# EAGLE design BasicGates (EAGLE 9.6.2)
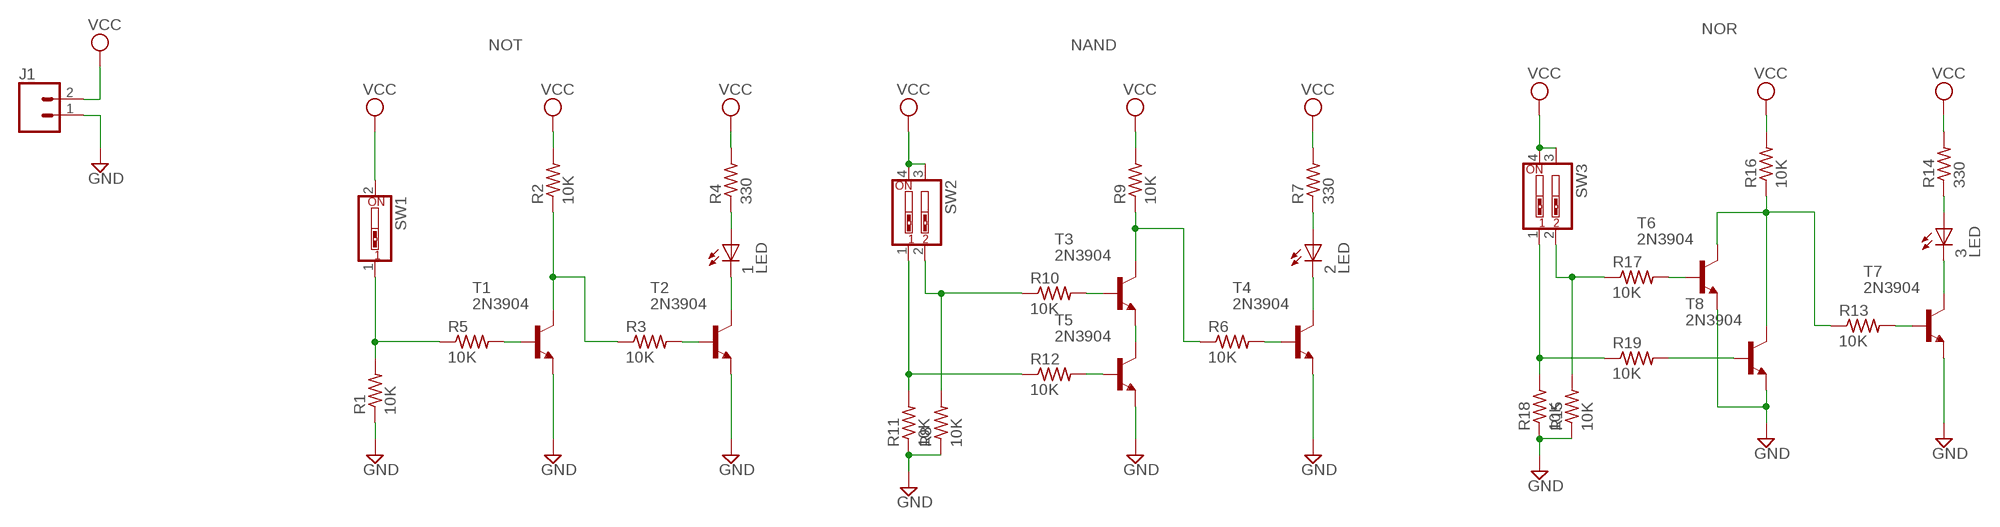
[diagram p0: schematic, sheet 1]

## Parts
1  LED  LED5MM  [LED5MM]
2  LED  LED5MM  [LED5MM]
3  LED  LED5MM  [LED5MM]
J1  CONN_02  [1X02]
R1  10K  R-US_0309/10  [0309/10]
R2  10K  R-US_0309/10  [0309/10]
R3  10K  R-US_0309/10  [0309/10]
R4  330  R-US_0309/10  [0309/10]
R5  10K  R-US_0309/10  [0309/10]
R6  10K  R-US_0309/10  [0309/10]
R7  330  R-US_0309/10  [0309/10]
R8  10K  R-US_0309/10  [0309/10]
R9  10K  R-US_0309/10  [0309/10]
R10  10K  R-US_0309/10  [0309/10]
R11  10K  R-US_0309/10  [0309/10]
R12  10K  R-US_0309/10  [0309/10]
R13  10K  R-US_0309/10  [0309/10]
R14  330  R-US_0309/10  [0309/10]
R15  10K  R-US_0309/10  [0309/10]
R16  10K  R-US_0309/10  [0309/10]
R17  10K  R-US_0309/10  [0309/10]
R18  10K  R-US_0309/10  [0309/10]
R19  10K  R-US_0309/10  [0309/10]
SW1  SW_DIP-1  [EDG-01]
SW2  SW_DIP-2  [EDG-02]
SW3  SW_DIP-2  [EDG-02]
T1  2N3904  [TO92]
T2  2N3904  [TO92]
T3  2N3904  [TO92]
T4  2N3904  [TO92]
T5  2N3904  [TO92]
T6  2N3904  [TO92]
T7  2N3904  [TO92]
T8  2N3904  [TO92]

## Nets
GND: J1.1 R1.1 R8.1 R11.1 R15.1 R18.1 T1.3(E) T2.3(E) T4.3(E) T5.3(E) T6.3(E) T7.3(E) T8.3(E)
N$1: R2.1 R3.1 T1.1(C)
N$2: R5.2 T1.2(B)
N$3: R1.2 R5.1 SW1.1
N$4: R6.2 T4.2(B)
N$5: 2.A R7.1
N$6: 2.K(C) T4.1(C)
N$7: R6.1 R9.1 T3.1(C)
N$8: R10.2 T3.2(B)
N$9: R8.2 R10.1 SW2.2
N$10: T3.3(E) T5.1(C)
N$11: R12.2 T5.2(B)
N$12: R11.2 R12.1 SW2.1
N$13: R13.2 T7.2(B)
N$14: 3.A R14.1
N$15: 3.K(C) T7.1(C)
N$16: R13.1 R16.1 T6.1(C) T8.1(C)
N$17: R17.2 T6.2(B)
N$18: R15.2 R17.1 SW3.2
N$20: R19.2 T8.2(B)
N$21: R18.2 R19.1 SW3.1
N$121: 1.A R4.1
N$122: R3.2 T2.2(B)
N$124: 1.K(C) T2.1(C)
VCC: J1.2 R2.2 R4.2 R7.2 R9.2 R14.2 R16.2 SW1.2 SW2.3 SW2.4 SW3.3 SW3.4

## Notes on the sheet
- NOR
- NOT | NAND

## Library data of the parts
1-3 = led:LED: LED OSRAM: - CHIPLED LG R971, LG N971, LY N971, LG Q971, LY Q971, LO R971, LY R971 LH N974, LH R974 LS Q976, LO Q976, LY Q976 LO Q996 - Hyper CHIPLED LW Q18S LB Q993, LB Q99A, LB R99A - SideLED LS A670, LO A670, LY A670, LG A670, LP A670 LB A673, LV A673, LT A673, LW A673 LH A674 LY A675 LS A676, LA A676, LO A676, LY A676, LW A676 LS A679, LY A679, LG A679 - Hyper Micro SIDELED® LS Y876, LA Y876, LO Y876, LY Y876 LT Y87S - SmartLED LW L88C, LW L88S LB L89C, LB L89S, LG L890 LS L89K, LO L89K, LY L89K LS L896, LA L896, LO L896, LY L896 - TOPLED LS T670, LO T670, LY T670, LG T670, LP T670 LSG T670, LSP T670, LSY T670, LOP T670, LYG T670 LG T671, LOG T671, LSG T671 LB T673, LV T673, LT T673, LW T673 LH T674 LS T676, LA T676, LO T676, LY T676, LB T676, LH T676, LSB T676, LW T676 LB T67C, LV T67C, LT T67C, LS T67K, LO T67K, LY T67K, LW E67C LS E67B, LA E67B, LO E67B, LY E67B, LB E67C, LV E67C, LT E67C LW T67C LS T679, LY T679, LG T679 LS T770, LO T770, LY T770, LG T770, LP T770 LB T773, LV T773, LT T773, LW T773 LH T774 LS E675, LA E675, LY E675, LS T675 LS T776, LA T776, LO T776, LY T776, LB T776 LHGB T686 LT T68C, LB T68C - Hyper Mini TOPLED® LB M676 - Mini TOPLED Santana® LG M470 LS M47K, LO M47K, LY M47K Source: http://www.osram.convergy.de LUXEON: - LUMILED® LXK2-PW12-R00, LXK2-PW12-S00, LXK2-PW14-U00, LXK2-PW14-V00 LXK2-PM12-R00, LXK2-PM12-S00, LXK2-PM14-U00 LXK2-PE12-Q00, LXK2-PE12-R00, LXK2-PE12-S00, LXK2-PE14-T00, LXK2-PE14-U00 LXK2-PB12-K00, LXK2-PB12-L00, LXK2-PB12-M00, LXK2-PB14-N00, LXK2-PB14-P00, LXK2-PB14-Q00 LXK2-PR12-L00, LXK2-PR12-M00, LXK2-PR14-Q00, LXK2-PR14-R00 LXK2-PD12-Q00, LXK2-PD12-R00, LXK2-PD12-S00 LXK2-PH12-R00, LXK2-PH12-S00 LXK2-PL12-P00, LXK2-PL12-Q00, LXK2-PL12-R00 Source: www.luxeon.com KINGBRIGHT: KA-3528ASYC Source: www.kingbright.com
J1 = SparkFun-Connectors:CONN_02: Multi connection point. Often used as Generic Header-pin footprint for 0.1 inch spaced/style header connections On any of the 0.1 inch spaced packages, you can populate with these: Break Away Headers - Straight <https://www.sparkfun.com/products/116> (PRT-00116) Break Away Male Headers - Right Angle <https://www.sparkfun.com/products/553> (PRT-00553) Female Headers <https://www.sparkfun.com/products/115> (PRT-00115) Break Away Headers - Machine Pin <https://www.sparkfun.com/products/117> (PRT-00117) Break Away Female Headers - Swiss Machine Pin <https://www.sparkfun.com/products/743> (PRT-00743) For SCREWTERMINALS and SPRING TERMINALS visit here: Screw Terimnals on SparkFun.com <https://www.sparkfun.com/search/results?term=Screw+Terminals> (5mm/3.5mm/2.54mm spacing) This device is also useful as a general connection point to wire up your design to another part of your project. Our various solder wires solder well into these plated through hole pads. Hook-Up Wire - Assortment (Stranded, 22 AWG) <https://www.sparkfun.com/products/11375> (PRT-11375) Hook-Up Wire - Assortment (Solid Core, 22 AWG) <https://www.sparkfun.com/products/11367> (PRT-11367) View the entire wire category on our website here <https://www.sparkfun.com/categories/141> Special notes: Molex polarized connector foot print use with: PRT-08233 with associated crimp pins and housings. 2.54_SCREWTERM for use with PRT-10571. 3.5mm Screw Terminal footprints for PRT-08084 5mm Screw Terminal footprints for use with PRT-08432
R1-R19 = resistor:R-US_: RESISTOR, American symbol
SW1 = special:SW_DIP-1: DIP SWITCH
SW2 SW3 = special:SW_DIP-2: DIP SWITCH
T1-T8 = transistor:2N3904: NPN TRANSISTOR

## Board
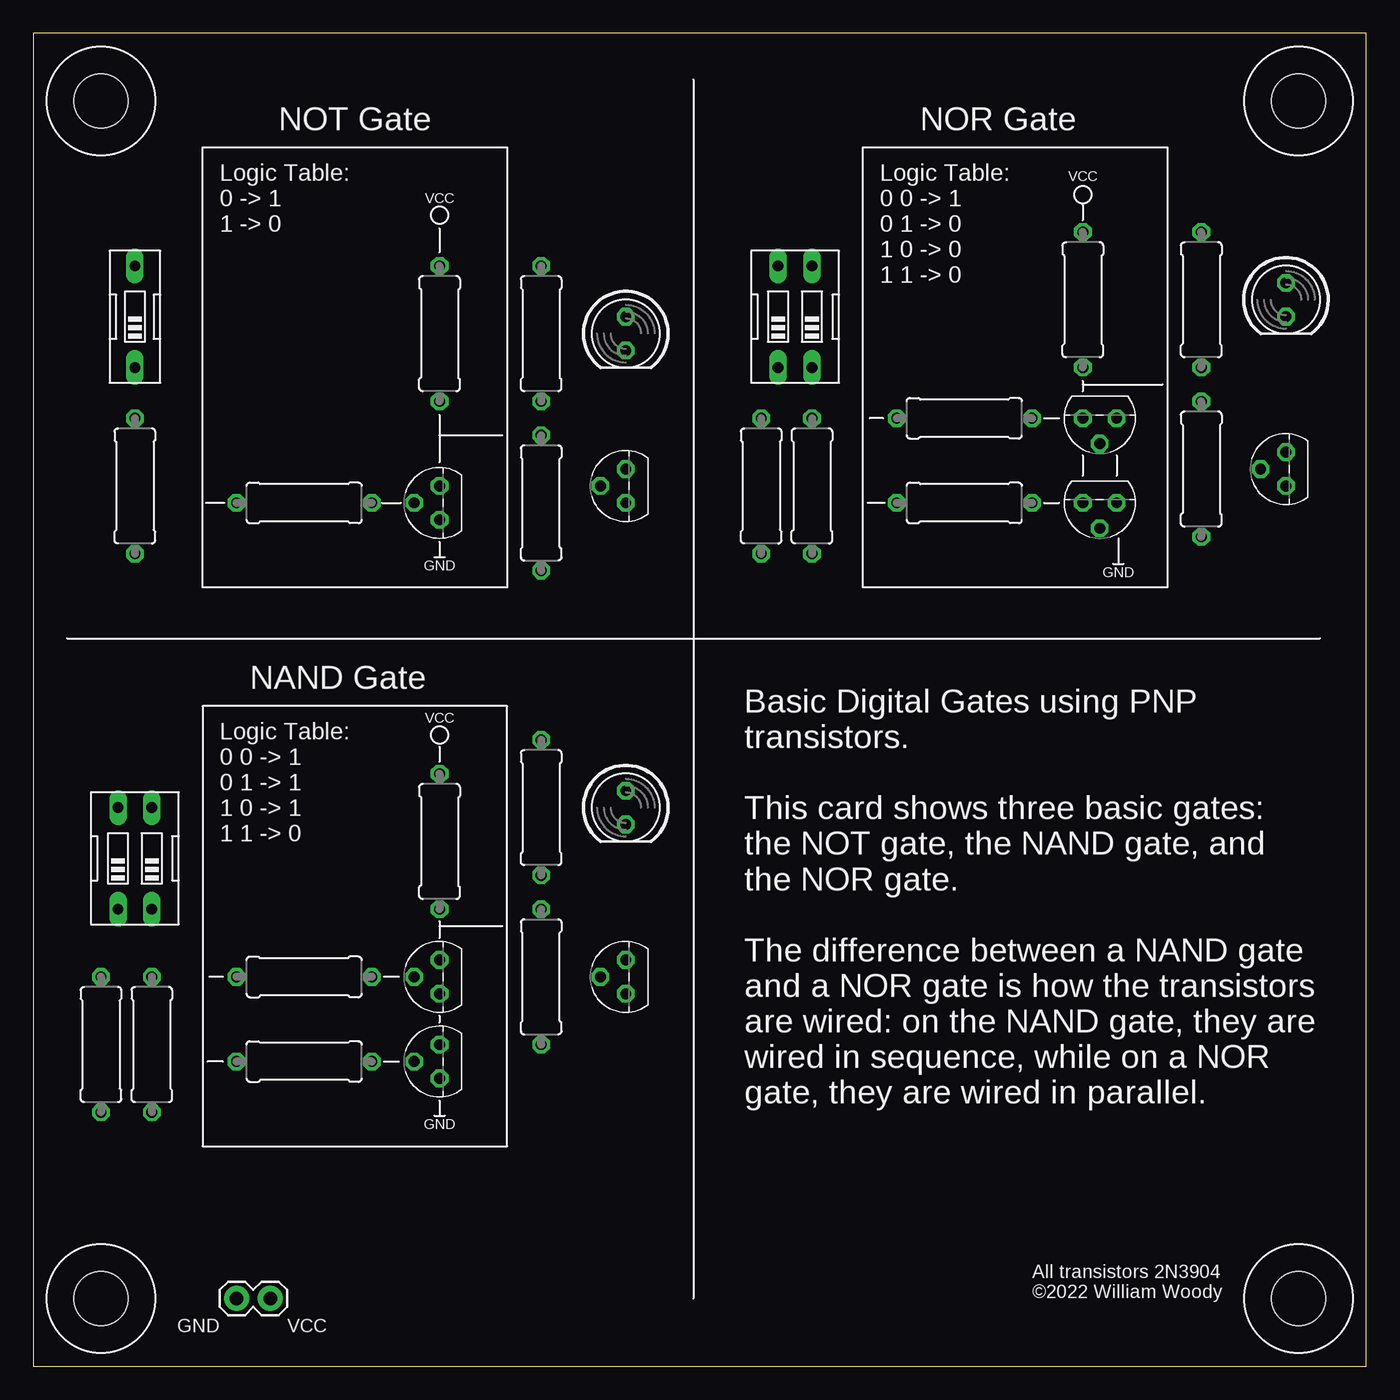
[diagram p1: board, top side]
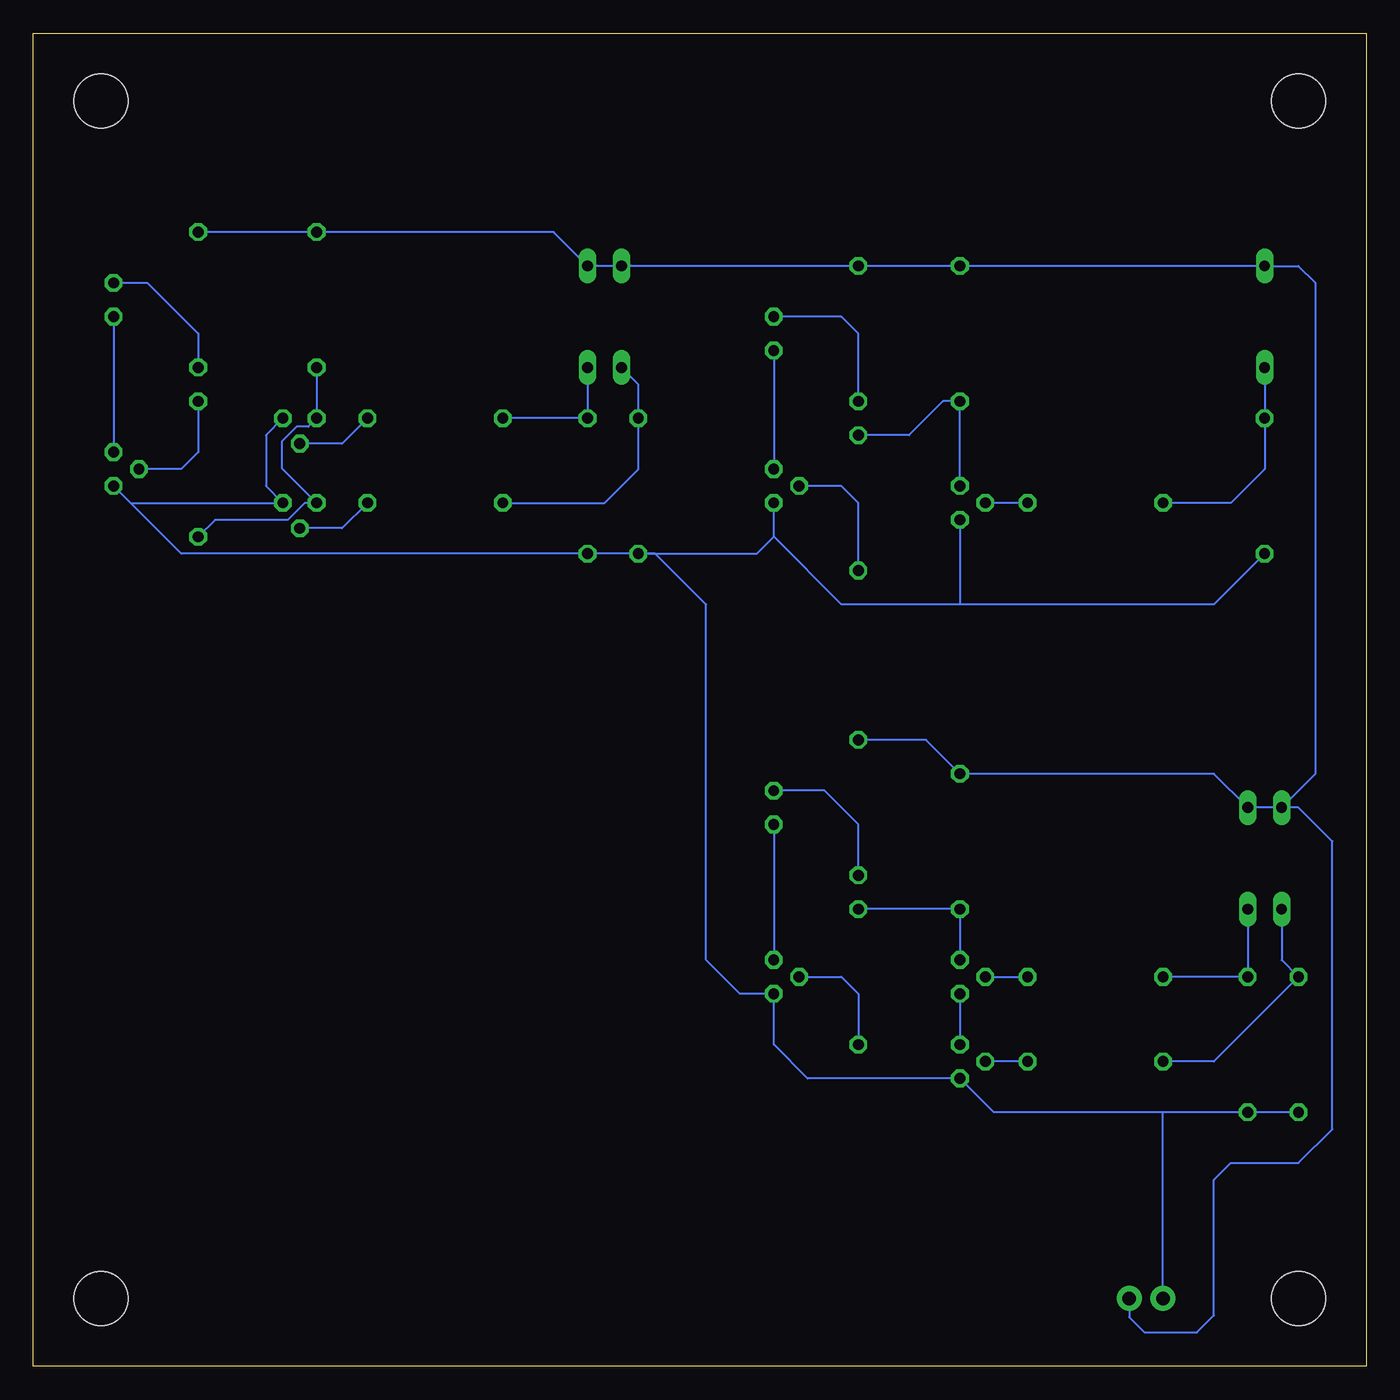
[diagram p2: board, bottom side, seen from below]

Size 100 x 100 mm. Coordinates in mm from the lower left corner, seen from the top.
Outline: 0,0 100,0 100,100 0,100 0,0
Copper layers (1*16): Top 0.035mm / dielectric 1.5mm / Bottom 0.035mm
Design rules "default": minimum track width 6mil, minimum drill 0.35mm, track to track 6mil, track to pad 6mil, pad to pad 6mil, via to via 6mil, smd to smd 6mil, copper to edge 40mil, drill to drill 6mil, minimum pad ring 10mil, minimum via ring 8mil, stop-mask expansion 4mil, vias tented up to drill 0mil, thermal gap 10mil
Holes 4.06 mm at 5.08,94.92 94.92,94.92 94.92,5.08 5.08,5.08

### Footprints (pad centres in the part's own frame; a part is rotated, then mirrored left to right if it is on the bottom)
LED5MM = drill 0.813 octagon: A -1.27,0; K 1.27,0
1X02 = drill 1.016 pad 1.88: 1 0,0; 2 2.54,0
0309/10 = drill 0.813 octagon: 1 -5.08,0; 2 5.08,0
EDG-01 = drill 0.813 long: 1 0,-3.81; 2 0,3.81
EDG-02 = drill 0.813 long: 1 -1.27,-3.81; 2 1.27,-3.81; 3 1.27,3.81; 4 -1.27,3.81
TO92 = drill 0.813 octagon: 1 1.27,0; 2 0,1.905; 3 -1.27,0

### Placement (x,y rotation side)
1  44.45,77.47 270 top
2  44.45,41.91 270 top
3  93.98,80.01 270 top
J1  15.24,5.08 0 top
R1  7.62,66.04 90 top
R2  30.48,77.47 90 top
R3  38.1,64.77 270 top
R4  38.1,77.47 90 top
R5  20.32,64.77 0 top
R6  38.1,29.21 270 top
R7  38.1,41.91 90 top
R8  8.89,24.13 90 top
R9  30.48,39.37 90 top
R10  20.32,29.21 0 top
R11  5.08,24.13 90 top
R12  20.32,22.86 0 top
R13  87.63,67.31 90 top
R14  87.63,80.01 90 top
R15  58.42,66.04 90 top
R16  78.74,80.01 90 top
R17  69.85,71.12 0 top
R18  54.61,66.04 90 top
R19  69.85,64.77 0 top
SW1  7.62,78.74 0 top
SW2  7.62,38.1 0 top
SW3  57.15,78.74 0 top
T1  30.48,64.77 90 top
T2  44.45,66.04 90 top
T3  30.48,29.21 90 top
T4  44.45,29.21 90 top
T5  30.48,22.86 90 top
T6  80.01,71.12 180 top
T7  93.98,67.31 90 top
T8  80.01,64.77 180 top

### Tracks (layer width: path | path; a pad name or v marks a point on that pad's centre or on a via)
GND
  Bottom 0.152: T7.3 92.71,64.77 | 92.71,64.77 T8.3 82.55,66.04 82.55,69.85 T6.3 | R18.1 R15.1 88.9,60.96 92.71,64.77 | 44.45,62.23 45.72,60.96 R18.1 | 44.45,62.23 T2.3 | R1.1 11.43,57.15 30.48,57.15 | 30.48,57.15 39.37,57.15 44.45,62.23 | R11.1 R8.1 15.24,19.05 | 15.24,19.05 27.94,19.05 T5.3 41.91,21.59 44.45,24.13 T4.3 46.99,27.94 49.53,30.48 49.53,57.15 53.34,60.96 R18.1 | J1.1 15.24,19.05 | T1.3 30.48,57.15
N$1
  Bottom 0.152: T1.1 R2.1 31.75,72.39 34.29,69.85 R3.1
N$2
  Bottom 0.152: R5.2 T1.2
N$3
  Bottom 0.152: SW1.1 R1.2 7.62,67.31 10.16,64.77 R5.1
N$4
  Bottom 0.152: T4.2 39.37,29.21 38.1,27.94 R6.2
N$5
  Bottom 0.152: R7.1 38.1,40.64 40.64,43.18 2.A
N$6
  Bottom 0.152: 2.K T4.1
N$7
  Bottom 0.152: R6.1 R9.1 T3.1
N$8
  Bottom 0.152: T3.2 R10.2
N$9
  Bottom 0.152: SW2.2 R8.2 R10.1
N$10
  Bottom 0.152: T3.3 T5.1
N$11
  Bottom 0.152: R12.2 T5.2
N$12
  Bottom 0.152: SW2.1 6.35,30.48 R11.2 11.43,22.86 R12.1
N$13
  Bottom 0.152: R13.2 87.63,68.58 88.9,67.31 T7.2
N$14
  Bottom 0.152: 3.A 91.44,81.28 87.63,77.47 R14.1
N$15
  Bottom 0.152: 3.K T7.1
N$16
  Bottom 0.152: R16.1 T6.1 79.38,70.48 80.25,70.48 81.36,69.38 81.36,67.39 T8.1 79.64,64.77 80.91,63.5 86.36,63.5 R13.1
N$17
  Bottom 0.152: R17.2 76.83,69.22 T6.2
N$18
  Bottom 0.152: SW3.2 R15.2 R17.1
N$20
  Bottom 0.152: R19.2 76.83,62.87 T8.2
N$21
  Bottom 0.152: R19.1 57.15,64.77 54.61,67.31 R18.2 54.61,73.66 SW3.1
N$121
  Bottom 0.152: R4.1 38.1,77.47 39.37,78.74 1.A
N$122
  Bottom 0.152: R3.2 38.1,64.77 39.37,66.04 T2.2
N$124
  Bottom 0.152: 1.K T2.1
VCC
  Bottom 0.152: R14.2 R16.2 60.96,85.09 SW3.3 SW3.4 R4.2 R2.2 SW1.2 5.08,82.55 3.81,81.28 3.81,44.45 SW2.4 | SW2.4 SW2.3 11.43,44.45 R9.2 33.02,46.99 R7.2 | J1.2 17.78,3.68 16.64,2.54 12.7,2.54 11.43,3.81 11.43,13.97 10.16,15.24 5.08,15.24 2.54,17.78 2.54,39.37 5.08,41.91 SW2.4

### Text on the board
tNames: NOT Gate | NOR Gate | Logic Table: / 0 -> 1 / 1 -> 0 | Logic Table: / 0 0 -> 1 / 0 1 -> 0 / 1 0 -> 0 / 1 1 -> 0 | VCC | VCC | GND | GND | NAND Gate | Basic Digital Gates using PNP / transistors. / / This card shows three basic gates: / the NOT gate, the NAND gate, and / the NOR gate. / / The difference between a NAND gate / and a NOR gate is how the transistors / are wired: on the NAND gate, they are / wired in sequence, while on a NOR / gate, they are wired in parallel. | Logic Table: / 0 0 -> 1 / 0 1 -> 1 / 1 0 -> 1 / 1 1 -> 0 | VCC | GND | All transistors 2N3904 / ©2022 William Woody | GND | VCC